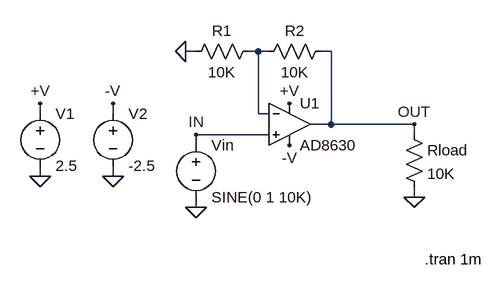
[diagram p0: schematic AD8630.asc]
AD8630.asc, the LTspice schematic file:
Version 4
SHEET 1 1240 700
WIRE 352 -864 336 -864
WIRE 448 -864 432 -864
WIRE 464 -864 448 -864
WIRE 560 -864 544 -864
WIRE 112 -768 112 -784
WIRE 224 -768 224 -784
WIRE 448 -768 448 -864
WIRE 464 -768 448 -768
WIRE 560 -752 560 -864
WIRE 560 -752 528 -752
WIRE 688 -752 560 -752
WIRE 464 -736 352 -736
WIRE 688 -736 688 -752
WIRE 352 -720 352 -736
WIRE 112 -672 112 -688
WIRE 224 -672 224 -688
WIRE 688 -640 688 -656
WIRE 352 -624 352 -640
FLAG 112 -784 +V
FLAG 112 -672 0
FLAG 352 -624 0
FLAG 688 -752 OUT
FLAG 352 -736 IN
FLAG 496 -784 +V
FLAG 224 -784 -V
FLAG 496 -720 -V
FLAG 336 -864 0
FLAG 688 -640 0
FLAG 224 -672 0
SYMBOL Opamps\\AD8630 496 -816 R0
SYMATTR InstName U1
SYMBOL voltage 112 -784 R0
WINDOW 123 0 0 Left 2
WINDOW 39 0 0 Left 2
SYMATTR InstName V1
SYMATTR Value 2.5
SYMBOL voltage 352 -736 R0
WINDOW 123 24 146 Left 2
WINDOW 39 24 125 Left 2
SYMATTR InstName Vin
SYMATTR Value SINE(0 1 10K)
SYMBOL res 448 -880 R90
WINDOW 0 0 56 VBottom 2
WINDOW 3 32 56 VTop 2
SYMATTR InstName R1
SYMATTR Value 10K
SYMBOL res 560 -880 R90
WINDOW 0 0 56 VBottom 2
WINDOW 3 32 56 VTop 2
SYMATTR InstName R2
SYMATTR Value 10K
SYMBOL voltage 224 -784 R0
WINDOW 123 24 146 Left 2
WINDOW 39 24 125 Left 2
SYMATTR InstName V2
SYMATTR Value -2.5
SYMBOL res 672 -752 R0
SYMATTR InstName Rload
SYMATTR Value 10K
TEXT 704 -544 Left 2 !.tran 1m

The netlist it stands for:
* AD8630.asc
XU1 IN N001 +V -V OUT AD8630  ; pins In+ In- V+ V- OUT
V1 +V 0 2.5
Vin IN 0 SINE(0 1 10K)
R1 N001 0 10K
R2 OUT N001 10K
V2 -V 0 -2.5
Rload OUT 0 10K
.tran 1m
.backanno
.end